# Altium schematic sheet brain.SchDoc
size A3; SheetNumber: 5; SheetTotal: 8
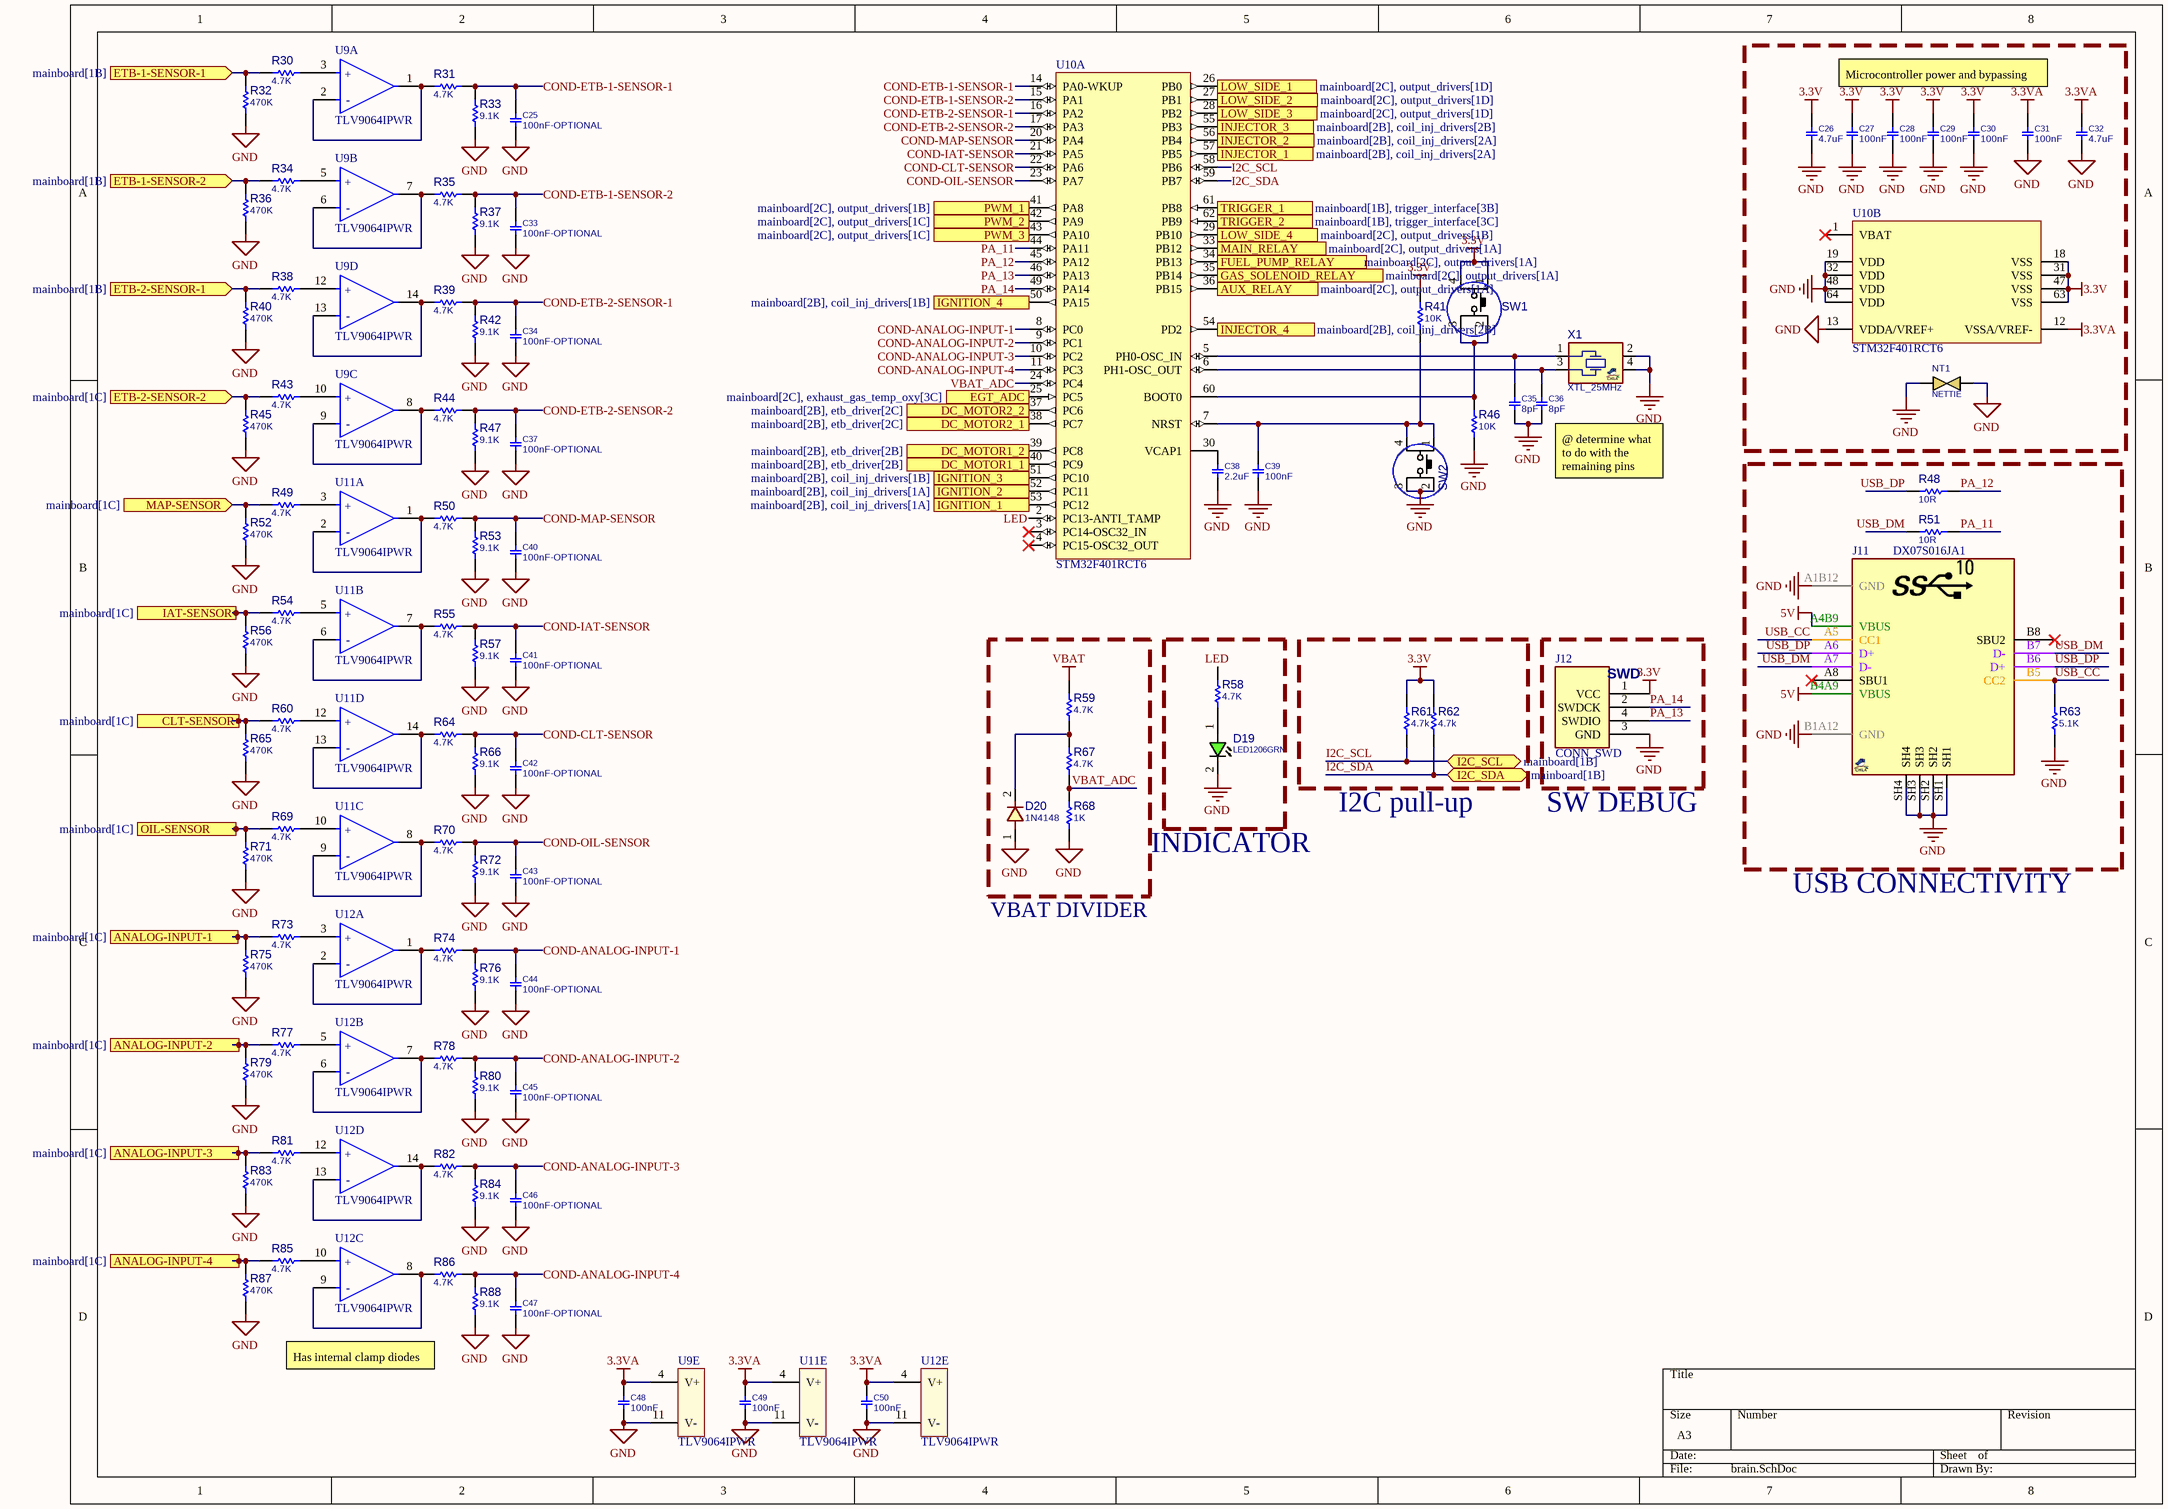
[diagram p0: brain.SchDoc]

## Parts
C25  100nF-OPTIONAL  [C0805]
C26  4.7uF  [C0805]
C27  100nF  [C0805]
C28  100nF  [C0805]
C29  100nF  [C0805]
C30  100nF  [C0805]
C31  100nF  [C0805]
C32  4.7uF  [C0805]
C33  100nF-OPTIONAL  [C0805]
C34  100nF-OPTIONAL  [C0805]
C35  8pF  [C0805]
C36  8pF  [C0805]
C37  100nF-OPTIONAL  [C0805]
C38  2.2uF  [C0805]
C39  100nF  [C0805]
C40  100nF-OPTIONAL  [C0805]
C41  100nF-OPTIONAL  [C0805]
C42  100nF-OPTIONAL  [C0805]
C43  100nF-OPTIONAL  [C0805]
C44  100nF-OPTIONAL  [C0805]
C45  100nF-OPTIONAL  [C0805]
C46  100nF-OPTIONAL  [C0805]
C47  100nF-OPTIONAL  [C0805]
C48  100nF  [C0805]
C49  100nF  [C0805]
C50  100nF  [C0805]
D19  LED1206GRN  [LED1206GRN]
D20  1N4148  [D_SOD80]
J11  DX07S016JA1  [USBC_SMD_16_DX07S016JA1]
J12  CONN_SWD  [WF_4]
NT1  NETTIE  [NETTIE_40X50]  (net tie, no BOM)
R30  4.7K  [R0805]
R31  4.7K  [R0805]
R32  470K  [R0805]
R33  9.1K  [R0805]
R34  4.7K  [R0805]
R35  4.7K  [R0805]
R36  470K  [R0805]
R37  9.1K  [R0805]
R38  4.7K  [R0805]
R39  4.7K  [R0805]
R40  470K  [R0805]
R41  10K  [R0805]
R42  9.1K  [R0805]
R43  4.7K  [R0805]
R44  4.7K  [R0805]
R45  470K  [R0805]
R46  10K  [R0805]
R47  9.1K  [R0805]
R48  10R  [R0805]
R49  4.7K  [R0805]
R50  4.7K  [R0805]
R51  10R  [R0805]
R52  470K  [R0805]
R53  9.1K  [R0805]
R54  4.7K  [R0805]
R55  4.7K  [R0805]
R56  470K  [R0805]
R57  9.1K  [R0805]
R58  4.7K  [R0805]
R59  4.7K  [R0805]
R60  4.7K  [R0805]
R61  4.7k  [R0805]
R62  4.7k  [R0805]
R63  5.1K  [R1206]
R64  4.7K  [R0805]
R65  470K  [R0805]
R66  9.1K  [R0805]
R67  4.7K  [R0805]
R68  1K  [R0805]
R69  4.7K  [R0805]
R70  4.7K  [R0805]
R71  470K  [R0805]
R72  9.1K  [R0805]
R73  4.7K  [R0805]
R74  4.7K  [R0805]
R75  470K  [R0805]
R76  9.1K  [R0805]
R77  4.7K  [R0805]
R78  4.7K  [R0805]
R79  470K  [R0805]
R80  9.1K  [R0805]
R81  4.7K  [R0805]
R82  4.7K  [R0805]
R83  470K  [R0805]
R84  9.1K  [R0805]
R85  4.7K  [R0805]
R86  4.7K  [R0805]
R87  470K  [R0805]
R88  9.1K  [R0805]
SW1  PUSHBUTTON  [SWPBS_SPDT_5X5X1]  (value not drawn)
SW2  PUSHBUTTON  [SWPBS_SPDT_5X5X1]  (value not drawn)
U9  TLV9064IPWR  [TTSOP-14]  (parts A,B,C,D,E of 5)
U10  STM32F401RCT6  [STM-LQFP64_L]  (parts A,B of 2)
U11  TLV9064IPWR  [TTSOP-14]  (parts A,B,C,D,E of 5)
U12  TLV9064IPWR  [TTSOP-14]  (parts A,B,C,D,E of 5)
X1  XTL_25MHz  [XTL_4_3225]

## Blocks framed on the sheet
VBAT DIVIDER: D20 R59 R67 R68

## Ports
ANALOG-INPUT-1 (in, see mainboard[1C]), ANALOG-INPUT-2 (in, see mainboard[1C]), ANALOG-INPUT-3 (in, see mainboard[1C]), ANALOG-INPUT-4 (in, see mainboard[1C]), AUX_RELAY (out, see mainboard[2C], output_drivers[1A]), CLT-SENSOR (in, see mainboard[1C]), DC_MOTOR1_1 (out, see mainboard[2B], etb_driver[2B]), DC_MOTOR1_2 (out, see mainboard[2B], etb_driver[2B]), DC_MOTOR2_1 (out, see mainboard[2B], etb_driver[2C]), DC_MOTOR2_2 (out, see mainboard[2B], etb_driver[2C]), EGT_ADC (in, see mainboard[2C], exhaust_gas_temp_oxy[3C]), ETB-1-SENSOR-1 (in, see mainboard[1B]), ETB-1-SENSOR-2 (in, see mainboard[1B]), ETB-2-SENSOR-1 (in, see mainboard[1B]), ETB-2-SENSOR-2 (in, see mainboard[1C]), FUEL_PUMP_RELAY (out, see mainboard[2C], output_drivers[1A]), GAS_SOLENOID_RELAY (out, see mainboard[2C], output_drivers[1A]), I2C_SCL (bidir, see mainboard[1B]), I2C_SDA (bidir, see mainboard[1B]), IAT-SENSOR (in, see mainboard[1C]), IGNITION_1 (out, see mainboard[2B], coil_inj_drivers[1A]), IGNITION_2 (out, see mainboard[2B], coil_inj_drivers[1A]), IGNITION_3 (out, see mainboard[2B], coil_inj_drivers[1B]), IGNITION_4 (out, see mainboard[2B], coil_inj_drivers[1B]), INJECTOR_1 (out, see mainboard[2B], coil_inj_drivers[2A]), INJECTOR_2 (out, see mainboard[2B], coil_inj_drivers[2A]), INJECTOR_3 (out, see mainboard[2B], coil_inj_drivers[2B]), INJECTOR_4 (out, see mainboard[2B], coil_inj_drivers[2B]), LOW_SIDE_1 (out, see mainboard[2C], output_drivers[1D]), LOW_SIDE_2 (out, see mainboard[2C], output_drivers[1D]), LOW_SIDE_3 (out, see mainboard[2C], output_drivers[1D]), LOW_SIDE_4 (out, see mainboard[2C], output_drivers[1B]), MAIN_RELAY (out, see mainboard[2C], output_drivers[1A]), MAP-SENSOR (in, see mainboard[1C]), OIL-SENSOR (in, see mainboard[1C]), PWM_1 (out, see mainboard[2C], output_drivers[1B]), PWM_2 (out, see mainboard[2C], output_drivers[1C]), PWM_3 (out, see mainboard[2C], output_drivers[1C]), TRIGGER_1 (in, see mainboard[1B], trigger_interface[3B]), TRIGGER_2 (in, see mainboard[1B], trigger_interface[3C])

## Nets
3.3V: C26.2 C27.2 C28.2 C29.2 C30.2 J12.1(VCC) R41.2 R61.2 R62.2 SW1.1(P1) SW1.4(P2) U10.18(VSS) U10.31(VSS) U10.47(VSS) U10.63(VSS)
3.3VA: C31.2 C32.2 C48.2 C49.2 C50.2 U9.4(V+) U10.12(VSSA/VREF-) U11.4(V+) U12.4(V+)
5V: J11.A4B9(VBUS) J11.B4A9(VBUS)
GND: C25.1 C26.1 C27.1 C28.1 C29.1 C30.1 C31.1 C32.1 C33.1 C34.1 C35.1 C36.1 C37.1 C38.1 C39.1 C40.1 C41.1 C42.1 C43.1 C44.1 C45.1 C46.1 C47.1 C48.1 C49.1 C50.1 D19.2(CATHODE) D20.1 J11.A1B12(GND) J11.B1A12(GND) J11.SH1 J11.SH2 J11.SH3 J11.SH4 J12.3(GND) NT1.1 NT1.2 R32.2 R33.2 R36.2 R37.2 R40.2 R42.2 R45.2 R46.1 R47.2 R52.2 R53.2 R56.2 R57.2 R63.1 R65.2 R66.2 R68.1 R71.2 R72.2 R75.2 R76.2 R79.2 R80.2 R83.2 R84.2 R87.2 R88.2 SW2.2(P3) SW2.3(P4) U9.11(V-) U10.13(VDDA/VREF+) U10.19(VDD) U10.32(VDD) U10.48(VDD) U10.64(VDD) U11.11(V-) U12.11(V-) X1.2 X1.4
VBAT: R59.2
ANALOG-INPUT-1: R73.2 R75.1 ; port ANALOG-INPUT-1
ANALOG-INPUT-2: R77.2 R79.1 ; port ANALOG-INPUT-2
ANALOG-INPUT-3: R81.2 R83.1 ; port ANALOG-INPUT-3
ANALOG-INPUT-4: R85.2 R87.1 ; port ANALOG-INPUT-4
AUX_RELAY: U10.36(PB15) ; port AUX_RELAY
CLT-SENSOR: R60.2 R65.1 ; port CLT-SENSOR
COND-ANALOG-INPUT-1: C44.2 R74.1 R76.1 U10.8(PC0)
COND-ANALOG-INPUT-2: C45.2 R78.1 R80.1 U10.9(PC1)
COND-ANALOG-INPUT-3: C46.2 R82.1 R84.1 U10.10(PC2)
COND-ANALOG-INPUT-4: C47.2 R86.1 R88.1 U10.11(PC3)
COND-CLT-SENSOR: C42.2 R64.1 R66.1 U10.22(PA6)
COND-ETB-1-SENSOR-1: C25.2 R31.1 R33.1 U10.14(PA0-WKUP)
COND-ETB-1-SENSOR-2: C33.2 R35.1 R37.1 U10.15(PA1)
COND-ETB-2-SENSOR-1: C34.2 R39.1 R42.1 U10.16(PA2)
COND-ETB-2-SENSOR-2: C37.2 R44.1 R47.1 U10.17(PA3)
COND-IAT-SENSOR: C41.2 R55.1 R57.1 U10.21(PA5)
COND-MAP-SENSOR: C40.2 R50.1 R53.1 U10.20(PA4)
COND-OIL-SENSOR: C43.2 R70.1 R72.1 U10.23(PA7)
DC_MOTOR1_1: U10.40(PC9) ; port DC_MOTOR1_1
DC_MOTOR1_2: U10.39(PC8) ; port DC_MOTOR1_2
DC_MOTOR2_1: U10.38(PC7) ; port DC_MOTOR2_1
DC_MOTOR2_2: U10.37(PC6) ; port DC_MOTOR2_2
EGT_ADC: U10.25(PC5) ; port EGT_ADC
ETB-1-SENSOR-1: R30.2 R32.1 ; port ETB-1-SENSOR-1
ETB-1-SENSOR-2: R34.2 R36.1 ; port ETB-1-SENSOR-2
ETB-2-SENSOR-1: R38.2 R40.1 ; port ETB-2-SENSOR-1
ETB-2-SENSOR-2: R43.2 R45.1 ; port ETB-2-SENSOR-2
FUEL_PUMP_RELAY: U10.34(PB13) ; port FUEL_PUMP_RELAY
GAS_SOLENOID_RELAY: U10.35(PB14) ; port GAS_SOLENOID_RELAY
I2C_SCL: R61.1 U10.58(PB6) ; port I2C_SCL
I2C_SDA: R62.1 U10.59(PB7) ; port I2C_SDA
IAT-SENSOR: R54.2 R56.1 ; port IAT-SENSOR
IGNITION_1: U10.53(PC12) ; port IGNITION_1
IGNITION_2: U10.52(PC11) ; port IGNITION_2
IGNITION_3: U10.51(PC10) ; port IGNITION_3
IGNITION_4: U10.50(PA15) ; port IGNITION_4
INJECTOR_1: U10.57(PB5) ; port INJECTOR_1
INJECTOR_2: U10.56(PB4) ; port INJECTOR_2
INJECTOR_3: U10.55(PB3) ; port INJECTOR_3
INJECTOR_4: U10.54(PD2) ; port INJECTOR_4
LED: R58.2 U10.2(PC13-ANTI_TAMP)
LOW_SIDE_1: U10.26(PB0) ; port LOW_SIDE_1
LOW_SIDE_2: U10.27(PB1) ; port LOW_SIDE_2
LOW_SIDE_3: U10.28(PB2) ; port LOW_SIDE_3
LOW_SIDE_4: U10.29(PB10) ; port LOW_SIDE_4
MAIN_RELAY: U10.33(PB12) ; port MAIN_RELAY
MAP-SENSOR: R49.2 R52.1 ; port MAP-SENSOR
OIL-SENSOR: R69.2 R71.1 ; port OIL-SENSOR
PA_11: R51.1 U10.44(PA11)
PA_12: R48.1 U10.45(PA12)
PA_13: J12.4(SWDIO) U10.46(PA13)
PA_14: J12.2(SWDCK) U10.49(PA14)
PWM_1: U10.41(PA8) ; port PWM_1
PWM_2: U10.42(PA9) ; port PWM_2
PWM_3: U10.43(PA10) ; port PWM_3
TRIGGER_1: U10.61(PB8) ; port TRIGGER_1
TRIGGER_2: U10.62(PB9) ; port TRIGGER_2
USB_CC: J11.A5(CC1) J11.B5(CC2) R63.2
USB_DM: J11.A7(D-) J11.B7(D-) R51.2
USB_DP: J11.A6(D+) J11.B6(D+) R48.2
VBAT_ADC: R67.1 R68.2 U10.24(PC4)
NetC35_2: C35.2 U10.5(PH0-OSC_IN) X1.1
NetC36_2: C36.2 U10.6(PH1-OSC_OUT) X1.3
NetC38_2: C38.2 U10.30(VCAP1)
NetC39_2: C39.2 R41.1 SW2.1(P1) SW2.4(P2) U10.7(NRST)
NetD19_1: D19.1(ANODE) R58.1
NetD20_2: D20.2 R59.1 R67.2
NetR30_1: R30.1 U9.3(IN1+)
NetR31_2: R31.2 U9.1(OUT1) U9.2(IN1-)
NetR34_1: R34.1 U9.5(IN2+)
NetR35_2: R35.2 U9.6(IN2-) U9.7(OUT2)
NetR38_1: R38.1 U9.12(IN4+)
NetR39_2: R39.2 U9.13(IN4-) U9.14(OUT4)
NetR43_1: R43.1 U9.10(IN3+)
NetR44_2: R44.2 U9.8(OUT3) U9.9(IN3-)
NetR46_2: R46.2 SW1.2(P3) SW1.3(P4) U10.60(BOOT0)
NetR49_1: R49.1 U11.3(IN1+)
NetR50_2: R50.2 U11.1(OUT1) U11.2(IN1-)
NetR54_1: R54.1 U11.5(IN2+)
NetR55_2: R55.2 U11.6(IN2-) U11.7(OUT2)
NetR60_1: R60.1 U11.12(IN4+)
NetR64_2: R64.2 U11.13(IN4-) U11.14(OUT4)
NetR69_1: R69.1 U11.10(IN3+)
NetR70_2: R70.2 U11.8(OUT3) U11.9(IN3-)
NetR73_1: R73.1 U12.3(IN1+)
NetR74_2: R74.2 U12.1(OUT1) U12.2(IN1-)
NetR77_1: R77.1 U12.5(IN2+)
NetR78_2: R78.2 U12.6(IN2-) U12.7(OUT2)
NetR81_1: R81.1 U12.12(IN4+)
NetR82_2: R82.2 U12.13(IN4-) U12.14(OUT4)
NetR85_1: R85.1 U12.10(IN3+)
NetR86_2: R86.2 U12.8(OUT3) U12.9(IN3-)

Not connected (* = marked no-connect by the designer): J11 A8(SBU1)* B8(SBU2)*; U10 1(VBAT)* 3(PC14-OSC32_IN)* 4(PC15-OSC32_OUT)*

## Notes on the sheet
- Microcontroller power and bypassing
- (near C36) @ determine what to do with the remaining pins
- INDICATOR
- I2C pull-up
- (near J12) SW DEBUG
- USB CONNECTIVITY
- Has internal clamp diodes
- (in symbol CONN_SWD) SWD
- (in symbol TLV9064, part A) +; -
- (in symbol TLV9064, part B) +; -
- (in symbol TLV9064, part C) +; -
- (in symbol TLV9064, part D) +; -

## Library data of the parts
C25-C50 = CAP_SMD_MLCC: CAP, MLCC; PARAM: C0G, 10%; DESC: CAP, MLCC, 1nF, 50V, C0G, 10%, 0402; MANF_P#: MANF_PART#; MANF: Murata; PARAM2: 50V; PRICE: 100= 1$; ASSEMBLY: ASSEMBLY
  C25 C33 C34 C37 C40-C47: VALUE: 100nF-OPTIONAL
  C26 C32: VALUE: 4.7uF
  C27-C31 C39 C48-C50: VALUE: 100nF
  C35 C36: VALUE: 8pF
  C38: VALUE: 2.2uF
D19 = LED_SMD_1206_GRN: LED, SMD, 1206, GREEN; PARAM: 20mA; DESC: DESCRIPTION; PARAM2: 2.2V; MANF: -; ASSEMBLY: ASSEMBLY; PRICE: 36t@Javan; MANF_P#: -; VALUE: LED1206GRN
D20 = DIODE_SMD_1N4148_SOD80: DIODE, FAST SWTICHING, 0.3A, 0.5W; DESC: DESCRIPTION; PARAM: 75V; PARAM2: 300mA, 0.5W; MANF: MANF; ASSEMBLY: ASSEMBLY; PRICE: PRICE; MANF_P#: 1N4148; VALUE: 1N4148
J11 = CONN_USBC_SMD_16_DX07S016JA1: CONN, USB, Type C, USB 2.0, Right-Angle, SMD; MANF: JAE; MANF_P#: DX07S016JA1R1500; PARAM: 5A; Price: 1.5$; Value: DX07S016JA1
J12 = CONN_SWD: CONN, SWD, ST; VALUE: CONN_SWD
NT1 = NETTIE_40X50: NET TIE; MANF: -; MANF_P#: -; VALUE: NETTIE
R30-R47 R49 R50 R52-R62 R64-R88 = RES_SMD: RESISTOR, SMD; PARAM: -W; DESC: DESCRIPTION; DIST#: MOUSER; PARAM2: 1%; MANF_P#: -; MANF: -; ASSEMBLY: ASSEMBLY; PRICE: 100= 0.5$
  R30 R31 R34 R35 R38 R39 R43 R44 R49 R50 R54 R55 R58-R60 R64 R67 R69 R70 R73 R74 R77 R78 R81 R82 R85 R86: VALUE: 4.7K
  R32 R36 R40 R45 R52 R56 R65 R71 R75 R79 R83 R87: VALUE: 470K
  R33 R37 R42 R47 R53 R57 R66 R72 R76 R80 R84 R88: VALUE: 9.1K
  R41 R46: VALUE: 10K
  R61 R62: VALUE: 4.7k
  R68: VALUE: 1K
R48 R51 = RES_SMD_0805: RESISTOR, SMD; PARAM: -W; DESC: DESCRIPTION; DIST#: MOUSER; PARAM2: 1%; MANF_P#: -; MANF: -; ASSEMBLY: ASSEMBLY; PRICE: 100= 0.5$; VALUE: 10R
R63 = RES_SMD_1206: RESISTOR, SMD; PARAM: 1%, 0.25W; DESC: DESCRIPTION; DIST#: MOUSER; MANF_P#: -; MANF: -; ASSEMBLY: ASSEMBLY; PRICE: -; PARAM2: -; VALUE: 5.1K
SW1 SW2 = SWPBS_SPDT_5X5PTS: SWITCH, PUSH BUTTON, TACTILE, SMD, SPDT, 5X5MM; MANF: CHINA; PARAM: 50mA; DESC: DESCRIPTION; MANF_P#: PTS526SM15SMTR2LFS; PARAM2: 500kCycle; VALUE: PUSHBUTTON; ASSEMBLY: ASSEMBLY; PRICE: -
U9 U11 U12 = TLV9064: IC CMOS 4 CIRCUIT 14TSSOP; Output Current per Channel: 50mA; Gain Bandwidth Product: 10MHz; Operating Supply Current: 538uA; Input Bias Current: 0.5pA; Input Offset Voltage (Vos): 300uV; Number of Channels: 4; Slew Rate: 6.5V/µs; Mount: Surface Mount; Min Operating Temperature: -40°C; Case/Package: TSSOP; RoHS Compliant: Yes; Packaging: Tape and Reel; Number of Pins: 14; Number of Circuits: 4; Max Operating Temperature: 125°C
U10 = STM32F401RCT6: ARM Cortex-M4 32-bit MCU+FPU, 105 DMIPS, 256 kB Flash, 64 kB Internal RAM, 48 I/Os, 64-pin LQFP, -40 to 85 degC, Tray; Manufacturer: STMicroelectronics; Internal RAM Size (kB): 64; Supply Voltage(Vcc) max (V): 3.6; FLASH Size (Prog) (kB): 256; I/Os (High Current): 48; Operating Frequency(F) (Processor speed) (MHz): 84; Supply Voltage(Vcc) min (V): 1.8; DatasheetVersion: Rev. 1; ComponentLink1URL: http://www.st.com/web/en/home.html; ComponentLink1Description: Manufacturer URL; PackageDescription: 64-Pin Low Profile Quad Flat Package, 10 x 10 mm Body, 0.5 mm Pitch; Packing: Tray; ComponentLink3URL: http://www.st.com/st-web-ui/static/active/en/resource/technical/document/datasheet/DM00037051.pdf; PackageVersion: Rev. 4, 06/2013; ComponentLink2URL: http://www.st.com/st-web-ui/static/active/en/resource/technical/document/data_brief/DM00071938.pdf; PartNumber: STM32F401RCT6; PackageReference: LQFP64; Mounting Technology: Surface Mount; ComponentLink2Description: Datasheet; ComponentLink3Description: Package Specification; Core: ARM Cortex-M4
X1 = XTL_4_25MHZ_3225A_2: CRYSTAL 25.00 MHZ 4pF, 10PPM; MANF: ABRACON; PARAM: 10PPM, 4pF, -40~85oC; DESC: DESCRIPTION; DIST#: MOUSER; MANF_P#: ABM8W-25.0000MHZ-4-D1X-T3; PARAM2: 0.6$; ASSEMBLY: ASSEMBLY; PRICE: PRICE; VALUE: XTL_25MHz